# Altium schematic sheet HIVE_SIGHT_MISC.SchDoc
size Tabloid; SheetNumber: 4; SheetTotal: 6; Sheet_Name: DECAWAVE; Size: 11x17
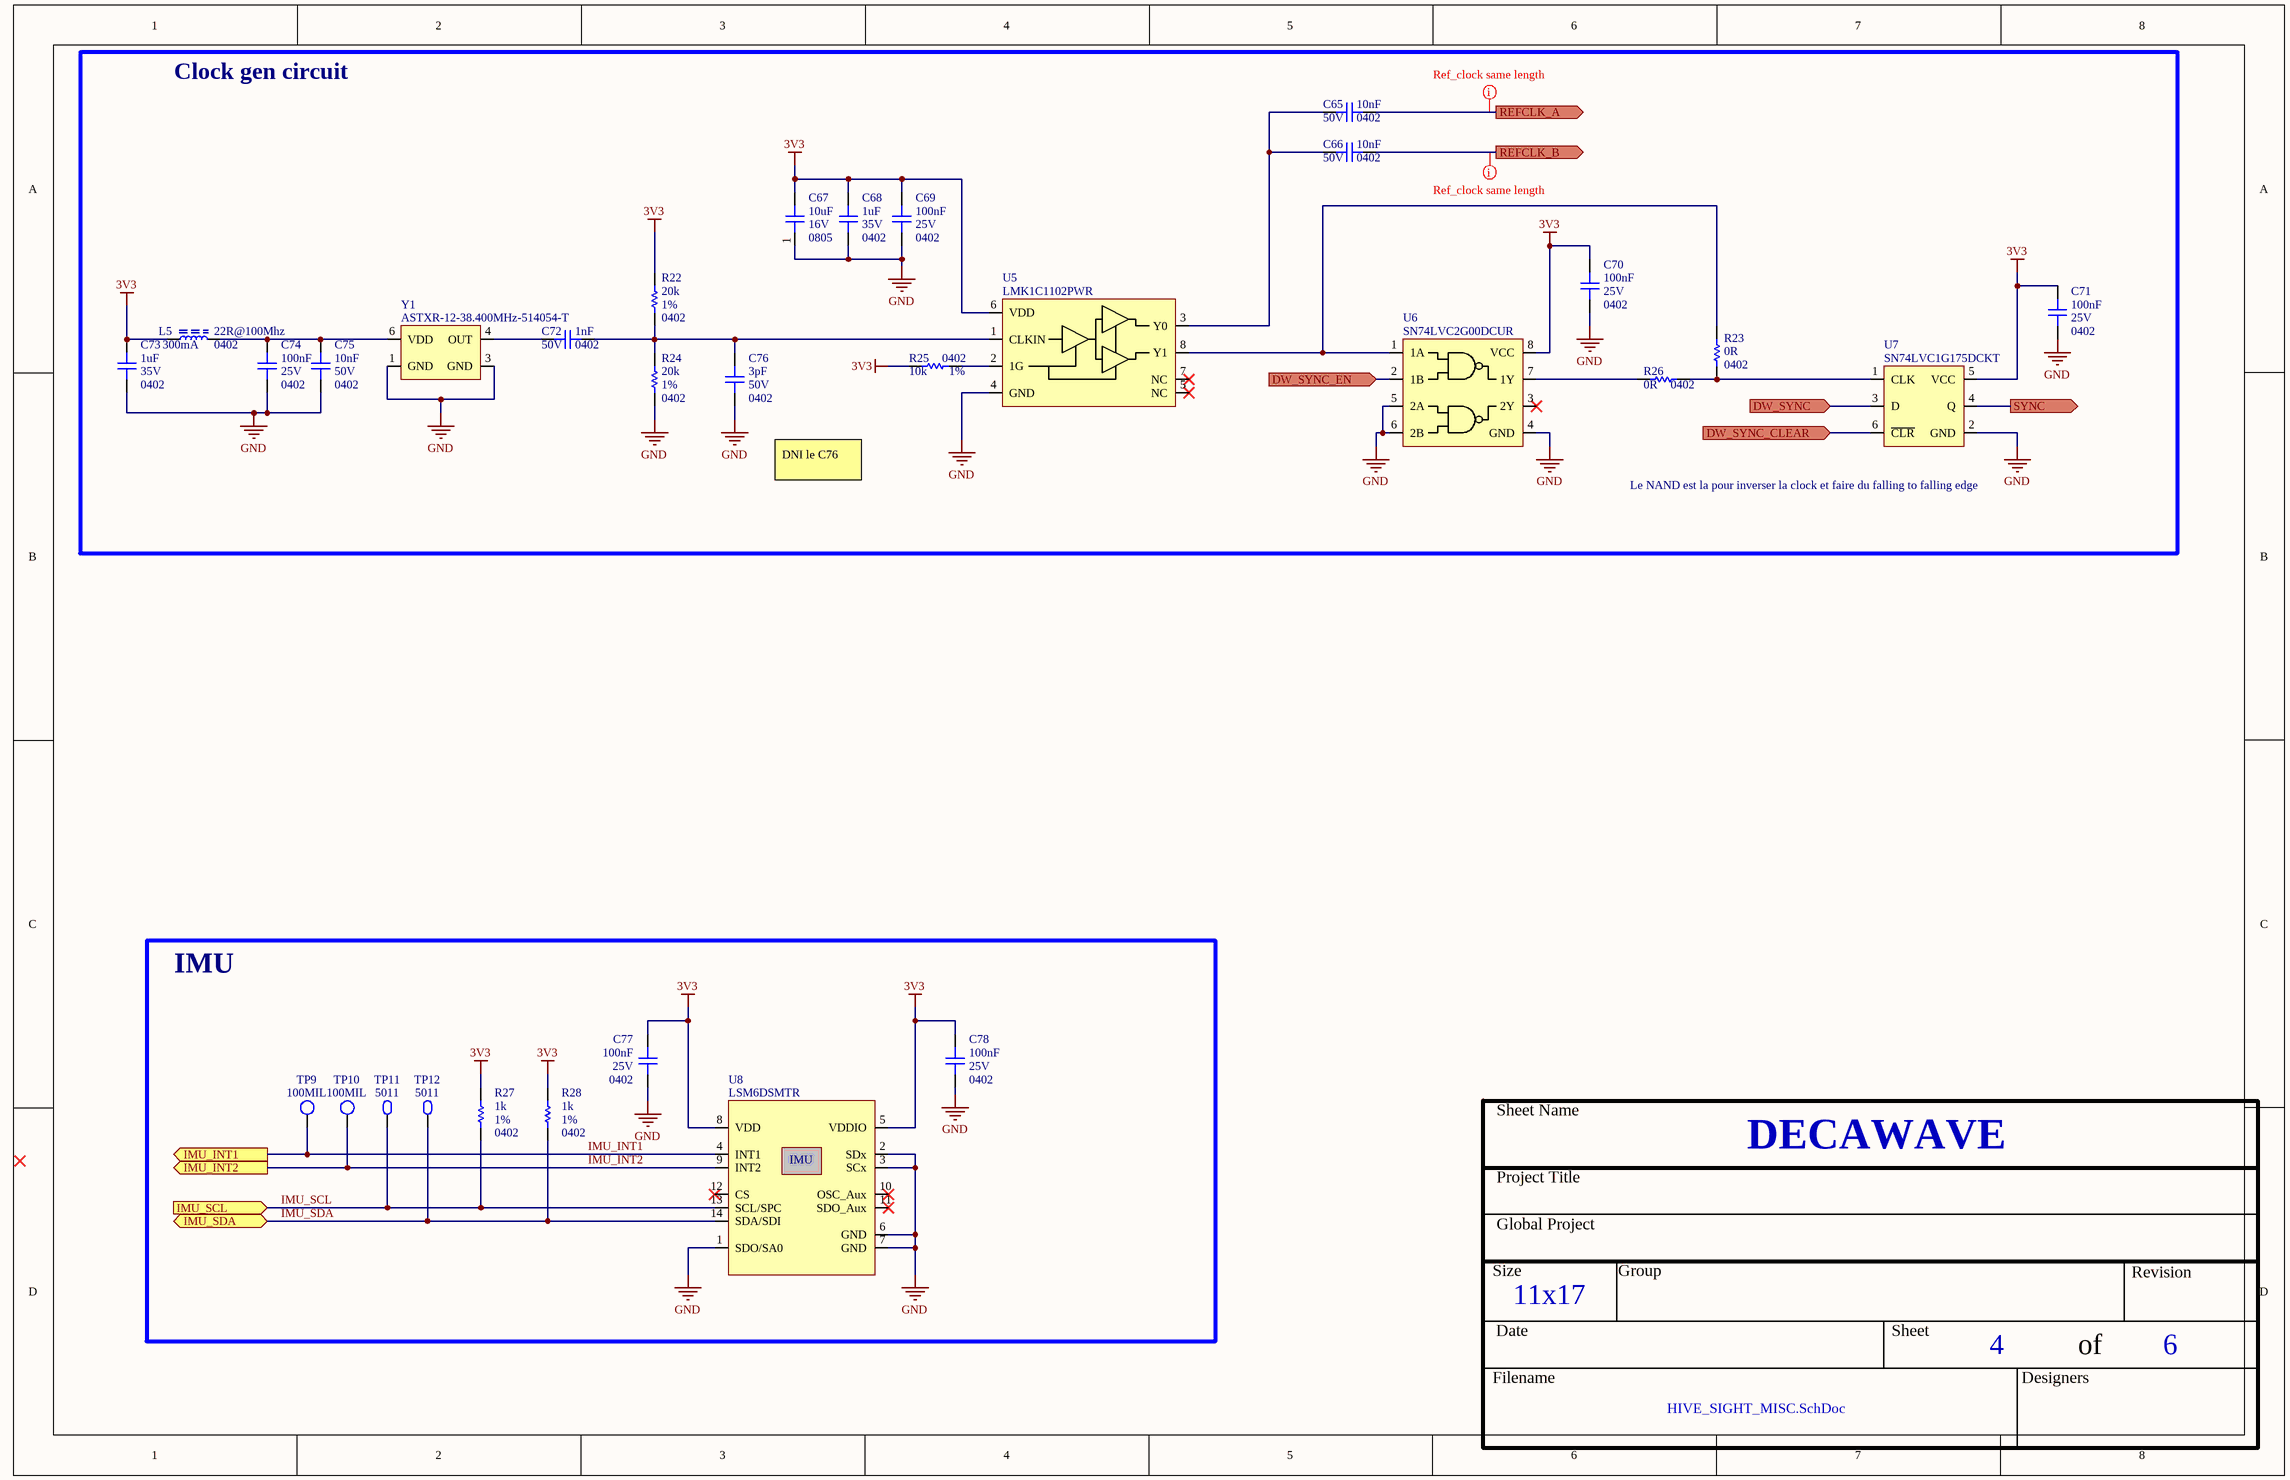
[diagram p0: HIVE_SIGHT_MISC.SchDoc]

## Parts
C65  value 10nF  Package: 0402  Voltage Rating: 50V  [CAP_CER_0402]  (hidden comment: CL05B103KB5NFNC)
C66  value 10nF  Package: 0402  Voltage Rating: 50V  [CAP_CER_0402]  (hidden comment: CL05B103KB5NFNC)
C67  value 10uF  Package: 0805  Voltage Rating: 16V  [CAP_CER_0805]  (hidden comment: GRM21BR61C106KE15K)
C68  value 1uF  Package: 0402  Voltage Rating: 35V  [CAP_CER_0402]  (hidden comment: CL05A105KL5NRNC)
C69  value 100nF  Package: 0402  Voltage Rating: 25V  [CAP_CER_0402]  (hidden comment: CGA2B3X7R1E104K050BB)
C70  value 100nF  Package: 0402  Voltage Rating: 25V  [CAP_CER_0402]  (hidden comment: CGA2B3X7R1E104K050BB)
C71  value 100nF  Package: 0402  Voltage Rating: 25V  [CAP_CER_0402]  (hidden comment: CGA2B3X7R1E104K050BB)
C72  value 1nF  Package: 0402  Voltage Rating: 50V  [CAP_CER_0402]  (hidden comment: CC0402KRX7R9BB102)
C73  value 1uF  Package: 0402  Voltage Rating: 35V  [CAP_CER_0402]  (hidden comment: CL05A105KL5NRNC)
C74  value 100nF  Package: 0402  Voltage Rating: 25V  [CAP_CER_0402]  (hidden comment: CGA2B3X7R1E104K050BB)
C75  value 10nF  Package: 0402  Voltage Rating: 50V  [CAP_CER_0402]  (hidden comment: CL05B103KB5NFNC)
C76  value 3pF  Package: 0402  Voltage Rating: 50V  [CAP_CER_0402]  (hidden comment: CC0402CRNPO9BN3R0)
C77  value 100nF  Package: 0402  Voltage Rating: 25V  [CAP_CER_0402]  (hidden comment: CGA2B3X7R1E104K050BB)
C78  value 100nF  Package: 0402  Voltage Rating: 25V  [CAP_CER_0402]  (hidden comment: CGA2B3X7R1E104K050BB)
L5  value 22R@100Mhz  Current Rating: 300mA  Package: 0402  [FER_0402]  (hidden comment: BLM15BB220SN1D)
R22  value 20k  Tolerance: 1%  Package: 0402  [RES_0402]  (hidden comment: RC0402FR-0720KL)
R23  value 0R  Package: 0402  [RES_0402]  (hidden comment: RC0402FR-070RL)
R24  value 20k  Tolerance: 1%  Package: 0402  [RES_0402]  (hidden comment: RC0402FR-0720KL)
R25  value 10k  Tolerance: 1%  Package: 0402  [RES_0402]  (hidden comment: RC0402FR-0710KL)
R26  value 0R  Package: 0402  [RES_0402]  (hidden comment: RC0402FR-070RL)
R27  value 1k  Tolerance: 1%  Package: 0402  [RES_0402]  (hidden comment: RC0402FR-071KL)
R28  value 1k  Tolerance: 1%  Package: 0402  [RES_0402]  (hidden comment: RC0402FR-071KL)
TP9  100MIL  [TPO_TH_ROUND_100MIL]  (no BOM)
TP10  100MIL  [TPO_TH_ROUND_100MIL]  (no BOM)
TP11  5011  [TPO_5011]
TP12  5011  [TPO_5011]
U5  LMK1C1102PWR  [COM_BUF_LMK1C1102PWR]
U6  SN74LVC2G00DCUR  [LOG_NAND_SN74LVC2G00DCUR]
U7  SN74LVC1G175DCKT  [LOG_FLIPFLOP_SN74LVC1G175DCKT]
U8  LSM6DSMTR  [SEN_IMU_LSM6DSMTR]
Y1  ASTXR-12-38.400MHz-514054-T  [OSC_ASTXR-12-38.400MHZ-514054-T]

## Blocks framed on the sheet
Clock gen circuit: C65-C76 L5 R22-R26 U5-U7 Y1
IMU: C77 C78 R27 R28 TP9-TP12 U8

## Ports
DW_SYNC (in), DW_SYNC_CLEAR (in), DW_SYNC_EN (in), IMU_INT1 (out), IMU_INT2 (out), IMU_SCL (in), IMU_SDA (bidir), REFCLK_A (out), REFCLK_B (out), SYNC (out)

## Nets
3V3: C67.2 C68.2 C69.2 C70.2 C71.1 C73.2 C77.1 C78.1 L5.1 R22.2 R25.2 R27.1 R28.1 U5.6(VDD) U6.8(VCC) U7.5(VCC) U8.5(VDDIO) U8.8(VDD)
GND: C67.1 C68.1 C69.1 C70.1 C71.2 C73.1 C74.1 C75.1 C76.1 C77.2 C78.2 R24.1 U5.4(GND) U6.4(GND) U6.5(2A) U6.6(2B) U7.2(GND) U8.1(SDO/SA0) U8.2(SDx) U8.3(SCx) U8.6(GND) U8.7(GND) Y1.1(GND) Y1.3(GND)
DW_SYNC: U7.3(D) ; port DW_SYNC
DW_SYNC_CLEAR: U7.6(~{CLR}) ; port DW_SYNC_CLEAR
DW_SYNC_EN: U6.2(1B) ; port DW_SYNC_EN
IMU_INT1: TP9.1 U8.4(INT1) ; port IMU_INT1
IMU_INT2: TP10.1 U8.9(INT2) ; port IMU_INT2
IMU_SCL: R27.2 TP11.1 U8.13(SCL/SPC) ; port IMU_SCL
IMU_SDA: R28.2 TP12.1 U8.14(SDA/SDI) ; port IMU_SDA
REFCLK_A: C65.1 ; port REFCLK_A
REFCLK_B: C66.1 ; port REFCLK_B
SYNC: U7.4(Q) ; port SYNC
NetC65_2: C65.2 C66.2 U5.3(Y0)
NetC72_1: C72.1 C76.2 R22.1 R24.2 U5.1(CLKIN)
NetC72_2: C72.2 Y1.4(OUT)
NetC74_2: C74.2 C75.2 L5.2 Y1.6(VDD)
NetR23_1: R23.1 R26.1 U7.1(CLK)
NetR23_2: R23.2 U5.8(Y1) U6.1(1A)
NetR25_1: R25.1 U5.2(1G)
NetR26_2: R26.2 U6.7(1Y)

Not connected (* = marked no-connect by the designer): U5 5(NC)* 7(NC)*; U6 3(2Y)*; U8 10(OSC_Aux)* 11(SDO_Aux)* 12(CS)*

## Layout directives
net class CLK_DW: REFCLK_A, REFCLK_B

## Notes on the sheet
- DNI le C76
- (near U7) Le NAND est la pour inverser la clock et faire du falling to falling edge
- Sheet Name
- Project Title
- Global Project
- Size
- Group
- Revision
- Date
- Sheet
- of
- Filename
- Designers
- (in symbol SEN_IMU_LSM6DSMTR) IMU

## Library data of the parts
C65 C66 C75 = CAP_CER_CL05B103KB5NFNC: CAP - CER 10nF ±10% 50V X7R - 0402; Manufacturer #1: Samsung Electro-Mechanics; GRAMS Lib Spec: 2.8; Magnetic Material: Unknown; Polarized: No; Assembly Type: SMD; CreatedBy/Date: Keven Deslandes - 2018/11/20; Current Rating: *; HelpURL: http://www.samsungsem.com/kr/support/product-search/mlcc/CL05B103KB5NFNC.jsp; Manufacturer #2: *; Note: *; Part Number #1: CL05B103KB5NFNC; Part Number #2: *; Power Max: *; Temperature: -55°C ~ 125°C; Tolerance: 10%; VerifiedBy: Nicolas Roy - 2018/12/11; Supplier 1: Digi-Key; Supplier Part Number 1: 1276-1499-1-ND; Cryo: UNKNOWN
C67 = CAP_CER_GRM21BR61C106KE15K: CAP - CER 10UF 10% 16V X5R - 0805; Manufacturer #1: Murata; GRAMS Lib Spec: 2.8; Magnetic Material: Unknown; Polarized: NO; Assembly Type: SMD; CreatedBy/Date: Caroline Paulin / 8 août 2018; Current Rating: *; HelpURL: https://search.murata.co.jp/Ceramy/image/img/A01X/G101/ENG/GRM21BR61C106KE15-01.pdf; Manufacturer #2: *; Note: *; Part Number #1: GRM21BR61C106KE15K; Part Number #2: *; Power Max: *; Temperature: -55°C ~ 85°C; Tolerance: 10%; VerifiedBy: Nicolas V. (2019-01-22); Supplier 1: Digi-Key; Supplier Part Number 1: 490-6473-1-ND
C68 C73 = CAP_CER_CL05A105KL5NRNC: CAP - CER 1uF 10% 35V X5R - 0402; Manufacturer #1: Samsung Electro-Mechanics; GRAMS Lib Spec: 2.8; Magnetic Material: Unknown; Polarized: NO; Assembly Type: SMD; CreatedBy/Date: Nicolas Roy 2018-10-03; Current Rating: *; HelpURL: http://www.samsungsem.com/kr/support/product-search/mlcc/__icsFiles/afieldfile/2018/06/19/CL05A105KL5NRNC.pdf; Manufacturer #2: *; Part Number #1: CL05A105KL5NRNC; Part Number #2: *; Power Max: *; Temperature: -55°C ~ 85°C; Tolerance: 10%; VerifiedBy: Caroline Paulin - 18 janv 2019; Supplier 1: Digi-Key; Supplier Part Number 1: 1276-6796-1-ND; Cryo: UNKNOWN
C69-C71 C74 C77 C78 = CAP_CER_CGA2B3X7R1E104K050BB: CAP - CER 0.1µF 10% 25V X7R - 0402; Manufacturer #1: TDK Corporation; GRAMS Lib Spec: 2.8; Magnetic Material: Unknown; Polarized: NO; Assembly Type: SMD; CreatedBy/Date: Nicolas Roy 2018-11-07; Current Rating: *; HelpURL: https://product.tdk.com/info/en/catalog/datasheets/mlcc_automotive_general_en.pdf; Manufacturer #2: *; Note: *; Part Number #1: CGA2B3X7R1E104K050BB; Part Number #2: *; Power Max: *; Temperature: -55°C ~ 125°C; Tolerance: 10%; VerifiedBy: Nicolas V. (2019-01-22); Supplier 1: Digi-Key; Supplier Part Number 1: 445-6902-1-ND; Cryo: UNKNOWN
C72 = CAP_CER_CC0402KRX7R9BB102: CAP - CER 1nF 10% 50V X7R - 0402; Manufacturer #1: Yageo; GRAMS Lib Spec: 2.8; Magnetic Material: UNKNOWN; Polarized: NO; Assembly Type: SMD; CreatedBy/Date: Jonathan Bouchard 2019-04-06; Current Rating: *; HelpURL: http://www.yageo.com/documents/recent/UPY-GPHC_X7R_6.3V-to-50V_18.pdf; Manufacturer #2: *; Note: *; Part Number #1: CC0402KRX7R9BB102; Part Number #2: *; Power Max: *; Temperature: -55°C ~ 125°C; Tolerance: 10%; VerifiedBy: Nicolas V. (2019-04-30); Supplier 1: Digi-Key; Supplier Part Number 1: 311-1036-1-ND; Cryo: UNKNOWN
C76 = CAP_CER_CC0402CRNPO9BN3R0: CAP - CER 3pF 50V ±0.25pF C0G, NP0 - 0402; Manufacturer #1: Yageo; GRAMS Lib Spec: 2.8; Magnetic Material: Unknown; Polarized: NO; Assembly Type: SMD; CreatedBy/Date: Philippe Arsenault/ 2020-07-24; Current Rating: *; HelpURL: https://www.yageo.com/upload/media/product/productsearch/datasheet/mlcc/UPY-GP_NP0_16V-to-50V_18.pdf; Manufacturer #2: *; Note: *; Part Number #1: CC0402CRNPO9BN3R0; Part Number #2: *; Power Max: *; Temperature: -55°C ~ 125°C; Tolerance: ±0.25pF; VerifiedBy: Louis-Daniel Gaulin / 2020-07-29; Cryo: UNKNOWN; Supplier 1: Digi-Key; Supplier Part Number 1: 311-1007-1-ND
L5 = FER_BLM15BB220SN1D: FER - FERRITE BEAD 22 OHM - 0402; Manufacturer #1: Murata; GRAMS Lib Spec: 2.8; Magnetic Material: YES; Polarized: NO; Cryo: UNKNOWN; Tolerance: *; Voltage Rating: *; Power Max: *; HelpURL: https://www.murata.com/en-us/products/productdata/8796740059166/ENFA0018.pdf; CreatedBy/Date: Philippe Arsenault/2020-11-03; Temperature: -55°C ~ 125°C; Manufacturer #2: *; Note: *; Assembly Type: SMD; Part Number #2: *; Part Number #1: BLM15BB220SN1D; Supplier 1: Digi-Key; Supplier Part Number 1: 490-5187-1-ND
R22 R24 = RES_RC0402FR-0720KL: RES - 20K 1% 1/16W  - 0402; Manufacturer #1: Yageo; GRAMS Lib Spec: 2.8; Magnetic Material: Unknown; Polarized: No; Voltage Rating: 50V; Assembly Type: SMD; CreatedBy/Date: Keven Deslandes 2018-10-18; Current Rating: *; HelpURL: http://www.yageo.com/documents/recent/PYu-RC_Group_51_RoHS_L_10.pdf; Manufacturer #2: *; Note: *; Part Number #1: RC0402FR-0720KL; Part Number #2: *; Power Max: 1/16W; Temperature: -55°C ~ 155°C; VerifiedBy: Caroline Paulin - 7 janv 2019; Supplier 1: Digi-Key; Supplier Part Number 1: 311-20.0KLRCT-ND; Cryo: UNKNOWN
R23 R26 = RES_RC0402FR-070RL: RES - 0R 1/16W 1A  - 0402; Manufacturer #1: Yageo; GRAMS Lib Spec: 2.8; Magnetic Material: Unknown; Polarized: No; Voltage Rating: 50V; Assembly Type: SMD; CreatedBy/Date: Keven Deslandes 2018-09-12; Current Rating: 1A; HelpURL: http://www.yageo.com/documents/recent/PYu-RC_Group_51_RoHS_L_10.pdf; Manufacturer #2: *; Note: *; Part Number #1: RC0402FR-070RL; Part Number #2: *; Power Max: 1/16W; Temperature: -55°C ~ 155°C; VerifiedBy: Caroline Paulin - 27 fév 2019; Supplier 1: Digi-Key; Supplier Part Number 1: 311-0.0LRCT-ND; Cryo: UNKNOWN
R25 = RES_RC0402FR-0710KL: RES - 10K OHMS 1% 1/16W - 0402; Manufacturer #1: Yageo; GRAMS Lib Spec: 2.8; Magnetic Material: UNKNOWN; Polarized: NO; Voltage Rating: 50V; Assembly Type: SMD; CreatedBy/Date: Nicolas V. (2018-11-20); Current Rating: *; HelpURL: http://www.yageo.com/documents/recent/PYu-RC_Group_51_RoHS_L_9.pdf; Manufacturer #2: *; Note: *; Part Number #1: RC0402FR-0710KL; Part Number #2: *; Power Max: 1/16W; Temperature: -55°C ~ 155°C; VerifiedBy: Nicolas V. (2018-11-20); Supplier 1: Digi-Key; Supplier Part Number 1: 311-10.0KLRCT-ND; Cryo: UNKNOWN
R27 R28 = RES_RC0402FR-071KL: RES - 1K OHM 1% 1/16W - 0402; Manufacturer #1: Yageo; GRAMS Lib Spec: 2.8; Magnetic Material: YES; Polarized: NO; Voltage Rating: 50V; Cryo: UNKNOWN; Assembly Type: SMD; CreatedBy/Date: Jonathan Bouchard 2018-07-05; Current Rating: *; HelpURL: http://www.yageo.com/documents/recent/PYu-RC_Group_51_RoHS_L_9.pdf; Manufacturer #2: *; Note: *; Part Number #1: RC0402FR-071KL; Part Number #2: *; Power Max: 1/16W; Temperature: -55°C ~ 155°C; VerifiedBy: Arnaud Samson 16-07-18; Supplier 1: Digi-Key; Supplier Part Number 1: 311-1.00KLRCT-ND
TP9 TP10 = TPO_TH_ROUND_100MIL: TPO - TEST POINT ROUND TH  - 100MIL; Magnetic Material: NO; GRAMS Lib Spec: 2.8c; Cryo: UNKNOWN; Current Rating: *; Manufacturer #1: *; Manufacturer #2: *; Note: *; Power Max: *; Value: *; Part Number #1: *; Part Number #2: *; HelpURL: *; Polarized: *; Supplier 1: *; Assembly Type: NONE; Supplier Part Number 1: *; Package: 100 MIL round; CreatedBy/Date: Louis-Daniel Gaulin/ 14/01/2020; Temperature: *; Tolerance: *; VerifiedBy: C.Paulin - 21/01/2020; Voltage Rating: *
TP11 TP12 = TPO_5011: TPO - TEST POINT - TH; Manufacturer #1: Keystone Electronics; Polarized: No; Magnetic Material: UNKNOWN; GRAMS Lib Spec: 2.8; Current Rating: *; Manufacturer #2: *; Note: *; Power Max: *; Value: *; Part Number #1: 5011; Part Number #2: *; HelpURL: https://www.keyelco.com/userAssets/file/M65p56.pdf; Assembly Type: TH; Package: *; CreatedBy/Date: Louis-Daniel Gauli / 02-11-2020; Temperature: *; Tolerance: *; VerifiedBy: Philippe Arsenault/2020-11-06; Voltage Rating: *; Cryo: UNKNOWN; Supplier 1: Digi-Key
U5 = COM_BUF_LMK1C1102PWR: COM - BUF - Clock buffer 3V3, 2V5, 1V8 2 Channel - TSSOP 8; Manufacturer #1: Texas Instruments; Voltage Rating: 1.71V ~ 1.89V, 2.375V ~ 2.625V, 3.135V ~ 3.465V; Current Rating: Input +-20mA ; Output +- 50mA; Power Max: 132mW; GRAMS Lib Spec: 2.8; Magnetic Material: Unknown; Polarized: Yes; Cryo: No; Value: *; Tolerance: *; HelpURL: https://www.ti.com/lit/ds/symlink/lmk1c1102.pdf?ts=1595262014854&ref_url=https%253A%252F%252Fwww.ti.com%252Fproduct%252FLMK1C1102%253Futm_source%253Dgoogle%2526utm_medium%253Dcpc%2526utm_campaign%253Dasc-null-null-GPN_EN-cpc-pf-google-wwe%2526utm_content%253DLMK1C1102%2526ds_k%253DLMK1C1102%2526DCM%253Dyes%2526gclid%253DCjwKCAjwgdX4BRB_EiwAg8O8HUIvo-ksMfq8YInqTklLXWuMoCGXxsnhq04Fqr4kdDFQPSc0fYG9iRoCPvAQAvD_BwE%2526gclsrc%253Daw.ds; CreatedBy/Date: Philippe Arsenault/20-07-2020; VerifiedBy: Louis-Daniel Gaulin / 23-07-2020; Temperature: –40°C to 125°C; Package: TSSOP 8 pin; Note: *; Assembly Type: SMT; Part Number #2: *; Part Number #1: LMK1C1102PWR
U6 = LOG_NAND_SN74LVC2G00DCUR: LOG_NAND - GATE NAND 2CH 2-INP - 8-VSSOP; Manufacturer #1: Texas Instruments; Voltage Rating: 1.65V ~ 5.5V; Current Rating: +-100mA; GRAMS Lib Spec: 2.8; Magnetic Material: Unknown; Polarized: Yes; Cryo: No; Value: *; Tolerance: *; Power Max: *; HelpURL: https://www.ti.com/lit/ds/symlink/sn74lvc2g00.pdf?HQS=TI-null-null-alldatasheets-df-pf-SEP-wwe; CreatedBy/Date: Philippe Arsenault/21-07-2020; VerifiedBy: Louis-Daniel Gaulin / 23-07-2020; Temperature: -40°C ~ 125°C; Package: 8-VSSOP; Manufacturer #2: *; Note: *; Assembly Type: SMD; Part Number #2: *; Part Number #1: SN74LVC2G00DCUR; Supplier Part Number 1: 296-13258-1-ND; Supplier 1: Digi-key
U7 = LOG_FLIPFLOP_SN74LVC1G175DCKT: LOG_FLIPFLOP - Single D flip-flop with Asynchronous clear - SOT-363; Manufacturer #1: Texas Instruments; Part Number #1: SN74LVC1G175DCKR; Voltage Rating: 1.65V ~ 5.5V; Current Rating: 100mA; GRAMS Lib Spec: 2.8; Magnetic Material: Unknown; Polarized: Yes; Cryo: No; Value: *; Tolerance: *; Power Max: *; HelpURL: https://www.ti.com/lit/ds/symlink/sn74lvc1g175.pdf?ts=1594769483993&ref_url=https%253A%252F%252Fwww.google.com%252F; CreatedBy/Date: Philippe Arsenault/21-07-2020; VerifiedBy: Louis-Daniel Gaulin / 03-10-2020; Temperature: -40°C ~ 125°C; Package: SOT-363; Manufacturer #2: *; Note: *; Assembly Type: SMD; Part Number #2: *; Supplier 1: Digi-Key; Supplier Part Number 1: 296-16998-1-ND
U8 = SEN_IMU_LSM6DSMTR: SEN_IMU -  ACCEL/GYRO 6 Axis I2C/SPI - 14-VFLGA; Manufacturer #1: STMicroelectronics; Voltage Rating: 1.71V ~ 3.6V; Current Rating: 0.65mA; Power Max: 3mW; GRAMS Lib Spec: 2.7c; Magnetic Material: Unknown; Polarized: YES; Value: -; Tolerance: -; HelpURL: https://www.st.com/content/ccc/resource/technical/document/datasheet/76/27/cf/88/c5/03/42/6b/DM00218116.pdf/files/DM00218116.pdf/jcr:content/translations/en.DM00218116.pdf; CreatedBy/Date: Louis-Daniel Gaulin / 06-10-2020; VerifiedBy: Philippe Arsenault/2020-11-06; Temperature: -40°C ~ 85°C (TA); Package: 14-VFLGA; Manufacturer #2: -; Note: -; Assembly Type: SMD; Part Number #2: -; Part Number #1: LSM6DSMTR; Supplier 1: Digi-Key; Supplier Part Number 1: 497-16696-1-ND
Y1 = OSC_ASTXR-12-38.400MHz-514054-T: OSC - XTAL - ASTXR-12-38.400MHz-514054-T - 38.4MHz TXCO - Clipped sine - 3V3 +-0.5ppm UWB application; Manufacturer #1: Abracon LLC; Voltage Rating: 3.3V; Current Rating: 2mA; GRAMS Lib Spec: 2.8; Magnetic Material: Unknown; Polarized: Yes; Cryo: No; Value: 38.4MHz; Tolerance: *; Power Max: *; HelpURL: https://4donline.ihs.com/images/VipMasterIC/IC/ABRC/ABRC-S-A0001399357/ABRC-S-A0001399357-1.pdf?hkey=52A5661711E402568146F3353EA87419; CreatedBy/Date: Philippe Arsenault/18-07-2020; VerifiedBy: Louis-Daniel Gaulin / 03-10-2020; Temperature: -40°C ~ 85°C; Package: 6-SMD; Manufacturer #2: Rakon; Note: *; Assembly Type: SMT; Part Number #2: *; Part Number #1: ASTXR-12-38.400MHz-514054-T; Supplier 1: Digi-Key; Supplier Part Number 1: 535-13192-1-ND